# Altium schematic sheet PanelTSW.SchDoc
size A4
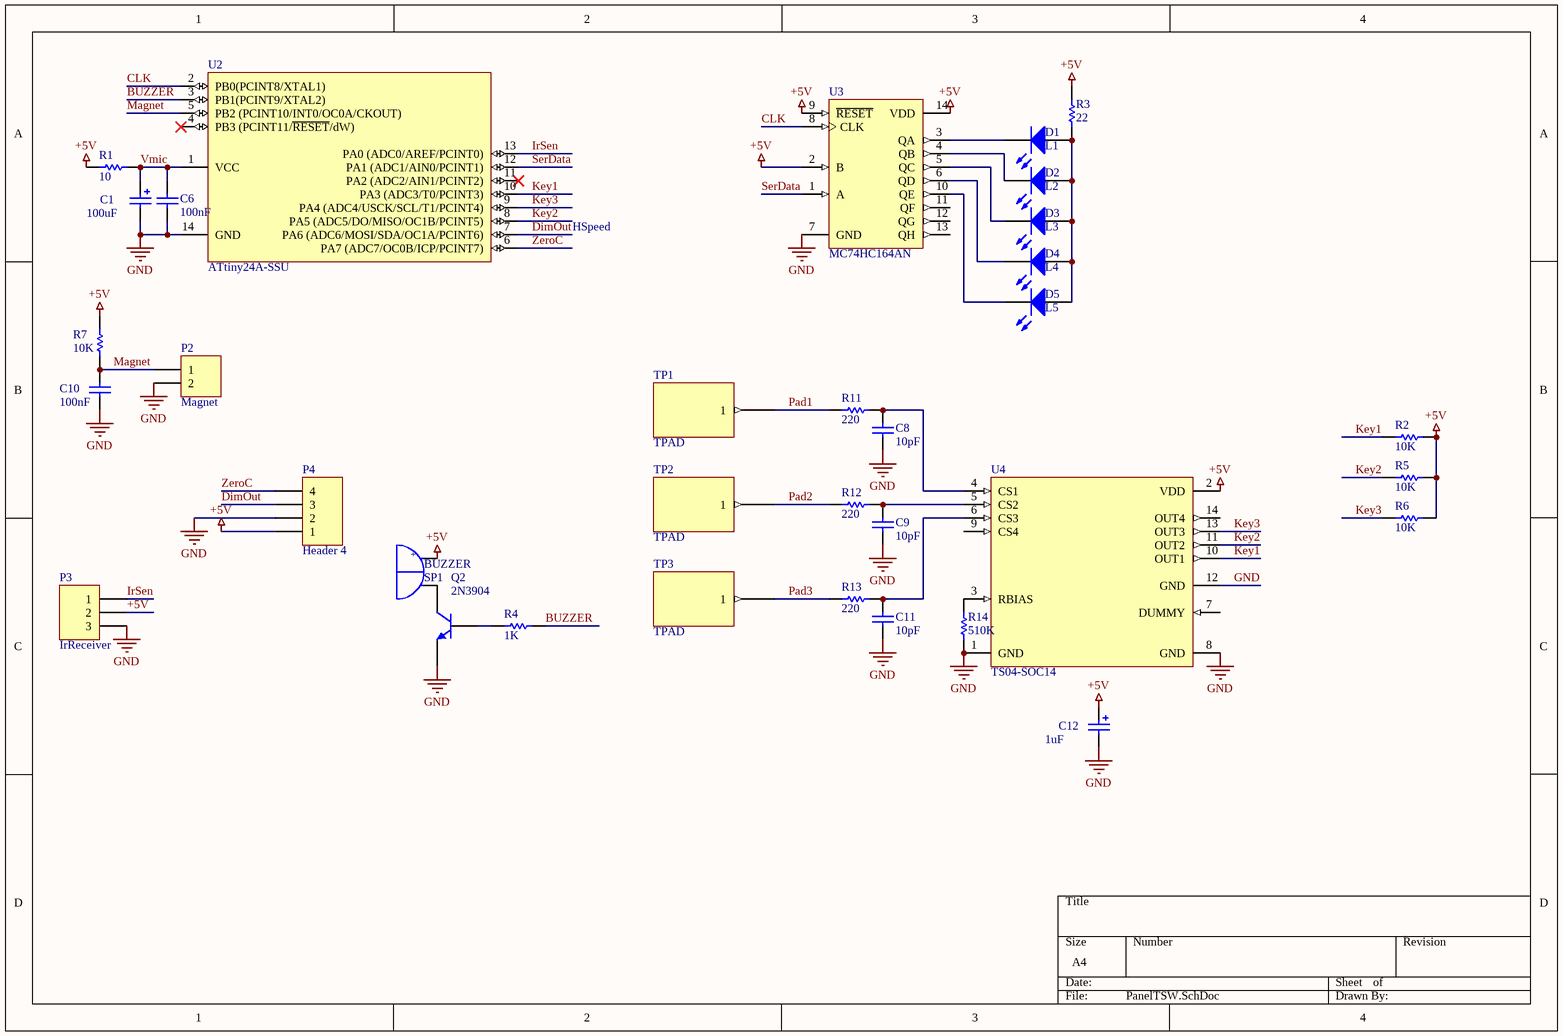
[diagram p0: PanelTSW.SchDoc]

## Parts
C1  100uF  [RB.15/.2]
C6  100nF  [RAD0.2]
C8  10pF  [1206C]
C9  10pF  [1206C]
C10  100nF  [RAD0.2]
C11  10pF  [1206C]
C12  1uF  [RB.15/.2]
D1  L1  [1206LED]
D2  L2  [1206LED]
D3  L3  [1206LED]
D4  L4  [1206LED]
D5  L5  [1206LED]
P2  Magnet  [Magnet]
P3  IrReceiver  [IrRec1]
P4  Header 4  [CON4]
Q2  2N3904  [TO92BS2]
R1  10  [RES0.35]
R2  10K  [1206R]
R3  22  [RES0.35]
R4  1K  [1206R]
R5  10K  [1206R]
R6  10K  [1206R]
R7  10K  [RES0.35]
R11  220  [1206R]
R12  220  [1206R]
R13  220  [1206R]
R14  510K  [1206R]
SP1  BUZZER  [RB.3/.6]
TP1  TPAD  [TPAD14x7]
TP2  TPAD  [TPAD14x7]
TP3  TPAD  [TPAD14x7]
U2  ATtiny24A-SSU  [SOIC14]
U3  MC74HC164AN  [SOIC14]
U4  TS04-SOC14  [SOIC14]

## Nets
+5V: C12.1 P3.2 P4.1 R1.2 R2.1 R3.1 R5.1 R6.1 R7.2 SP1.1 U3.2(B) U3.9(~{RESET}) U3.14(VDD) U4.2(VDD)
GND: C1.2 C6.1 C8.1 C9.1 C10.1 C11.1 C12.2 P2.2 P3.3 P4.2 Q2.3(E) R14.2 U2.14(GND) U3.7(GND) U4.1(GND) U4.8(GND) U4.12(GND)
BUZZER: R4.1 U2.3(PB1(PCINT9/XTAL2))
CLK: U2.2(PB0(PCINT8/XTAL1)) U3.8(CLK)
DimOut: P4.3 U2.7(PA6_(ADC6/MOSI/SDA/OC1A/PCINT6))
IrSen: P3.1 U2.13(PA0_(ADC0/AREF/PCINT0))
Key1: R2.2 U2.10(PA3_(ADC3/T0/PCINT3)) U4.10(OUT1)
Key2: R5.2 U2.8(PA5_(ADC5/DO/MISO/OC1B/PCINT5)) U4.11(OUT2)
Key3: R6.2 U2.9(PA4_(ADC4/USCK/SCL/T1/PCINT4)) U4.13(OUT3)
Magnet: C10.2 P2.1 R7.1 U2.5(PB2_(PCINT10/INT0/OC0A/CKOUT))
Pad1: R11.2 TP1.1
Pad2: R12.2 TP2.1
Pad3: R13.2 TP3.1
SerData: U2.12(PA1_(ADC1/AIN0/PCINT1)) U3.1(A)
Vmic: C1.1 C6.2 R1.1 U2.1(VCC)
ZeroC: P4.4 U2.6(PA7_(ADC7/OC0B/ICP/PCINT7))
NetC8_2: C8.2 R11.1 U4.4(CS1)
NetC9_2: C9.2 R12.1 U4.5(CS2)
NetC11_2: C11.2 R13.1 U4.6(CS3)
NetD1_1: D1.1(A) D2.1(A) D3.1(A) D4.1(A) D5.1(A) R3.2
NetD1_2: D1.2(K) U3.3(QA)
NetD2_2: D2.2(K) U3.4(QB)
NetD3_2: D3.2(K) U3.5(QC)
NetD4_2: D4.2(K) U3.6(QD)
NetD5_2: D5.2(K) U3.10(QE)
NetQ2_1: Q2.1(B) R4.2
NetQ2_2: Q2.2(C) SP1.2
NetR14_1: R14.1 U4.3(RBIAS)

Not connected (* = marked no-connect by the designer): U2 4(PB3_(PCINT11/~{RESET}/dW))* 11(PA2_(ADC2/AIN1/PCINT2))*; U3 11(QF) 12(QG) 13(QH); U4 7(DUMMY) 9(CS4) 14(OUT4)

## Notes on the sheet
- HSpeed
- (in symbol BUZZER) +

## Library data of the parts
C1 C12 = Cap Pol: Polarized Capacitor; Value: 100pF; Published: 8-Jun-2000; LatestRevisionDate: 17-Jul-2002; LatestRevisionNote: Re-released for DXP Platform.; PackageReference: RB7.6-15; Publisher: Altium Limited
C6 C8 C9 C11 = Cap: Capacitor; Value: 100pF; Published: 8-Jun-2000; LatestRevisionDate: 17-Jul-2002; LatestRevisionNote: Re-released for DXP Platform.; PackageReference: RAD-0.3; Publisher: Altium Limited
C10 = Cap: Capacitor SMD; Value: 100pF; Published: 8-Jun-2000; LatestRevisionDate: 17-Jul-2002; LatestRevisionNote: Re-released for DXP Platform.; PackageReference: RAD-0.3; Publisher: Altium Limited
D1-D5 = LED0.5: LED Radial 0.5; Published: 8-Jun-2000; LatestRevisionDate: 17-Dec-2003; LatestRevisionNote: PCB Footprint replaced.; DatasheetDocument: 16-Apr-2002; PackageDocument: 16-Apr-2002; PackageReference: 3.5X2.8X1.9; Publisher: Altium Limited
P2 = Header 2: Header, 2-Pin; LatestRevisionDate: 17-Jul-2002; LatestRevisionNote: Re-released for DXP Platform.; Publisher: Altium Limited
P3 = Header 3: 3pin; LatestRevisionDate: 17-Jul-2002; LatestRevisionNote: Re-released for DXP Platform.; Publisher: Altium Limited
P4 = Header 4: Header, 4-Pin; LatestRevisionDate: 17-Jul-2002; LatestRevisionNote: Re-released for DXP Platform.; Publisher: Altium Limited
Q2 = BC337: NPN General Purpose Amplifier; Published: 8-Jun-2000; LatestRevisionDate: 15-Jan-2003; LatestRevisionNote: PCB Footprint 'BCY-W3/D4.7' replaced; DatasheetDocument: 1997; PackageDocument: Sep-1998; PackageReference: TO-92A; Publisher: Altium Limited; Code_JEDEC: TO-92A; ComponentLink1Description: Manufacturer Link; ComponentLink1URL: http://www.fairchildsemi.com/; ComponentLink2Description: Datasheet; ComponentLink2URL: http://www.fairchildsemi.com/ds/2N%2F2N3904.pdf
R1-R7 R11-R14 = Resistor: Published: 8-Jun-2000; LatestRevisionDate: 17-Jul-2002; LatestRevisionNote: Re-released for DXP Platform.; PackageReference: AXIAL-0.5; Publisher: Altium Limited
SP1 = BUZZER: 5Volt; Text Field1: 40; Text Field2: 20
TP1-TP3 = PAD14x7: Touch Pad
U2 = ATtiny24-16PC: 8-Bit AVR Microcontroller with 2K Bytes of Flash Memory; Published: 17-Sep-2003; LatestRevisionDate: 04-Mar-2005; LatestRevisionNote: Stylized 3D Model Added.; DatasheetVersion: 1477C-AVR-09/02; PackageVersion: Aug-1999; PackageReference: 20P3; Publisher: Altium Limited; PackageDescription: DIP; 20 Leads; Row Spacing 7.62 mm; Pitch 2.54 mm; Code_JEDEC: MS-001-AD; ComponentLink1Description: Manufacturer Link; ComponentLink1URL: http://www.atmel.com; ComponentLink2Description: Datasheet; ComponentLink2URL: http://www.atmel.com/dyn/resources/prod_documents/doc1477.pdf
U3 = MC74HC164AN: 8-Bit Serial Input / Parallel-Output Shift Register; Published: 15-Apr-2002; DatasheetVersion: Mar-2000; PackageVersion: 1995; PackageReference: 646-06; Publisher: Altium Limited; PackageDescription: DIP; 14 Leads; Row Spacing 7.62 mm; Pitch 2.54 mm; ComponentLink1Description: Manufacturer Link; ComponentLink1URL: http://www.onsemi.com/; ComponentLink2Description: Datasheet; ComponentLink2URL: http://www.onsemi.com/pub/Collateral/MC74HC164A-D.PDF
U4 = TS04: Touch swith; Published: 17-Sep-2003; LatestRevisionDate: 04-Mar-2005; LatestRevisionNote: Stylized 3D Model Added.; DatasheetVersion: 1477C-AVR-09/02; PackageVersion: Aug-1999; PackageReference: 20P3; Publisher: Altium Limited; PackageDescription: DIP; 20 Leads; Row Spacing 7.62 mm; Pitch 2.54 mm; Code_JEDEC: MS-001-AD; ComponentLink1Description: Manufacturer Link; ComponentLink1URL: http://www.atmel.com; ComponentLink2Description: Datasheet; ComponentLink2URL: http://www.atmel.com/dyn/resources/prod_documents/doc1477.pdf